# Altium project mcs4.PrjPcb
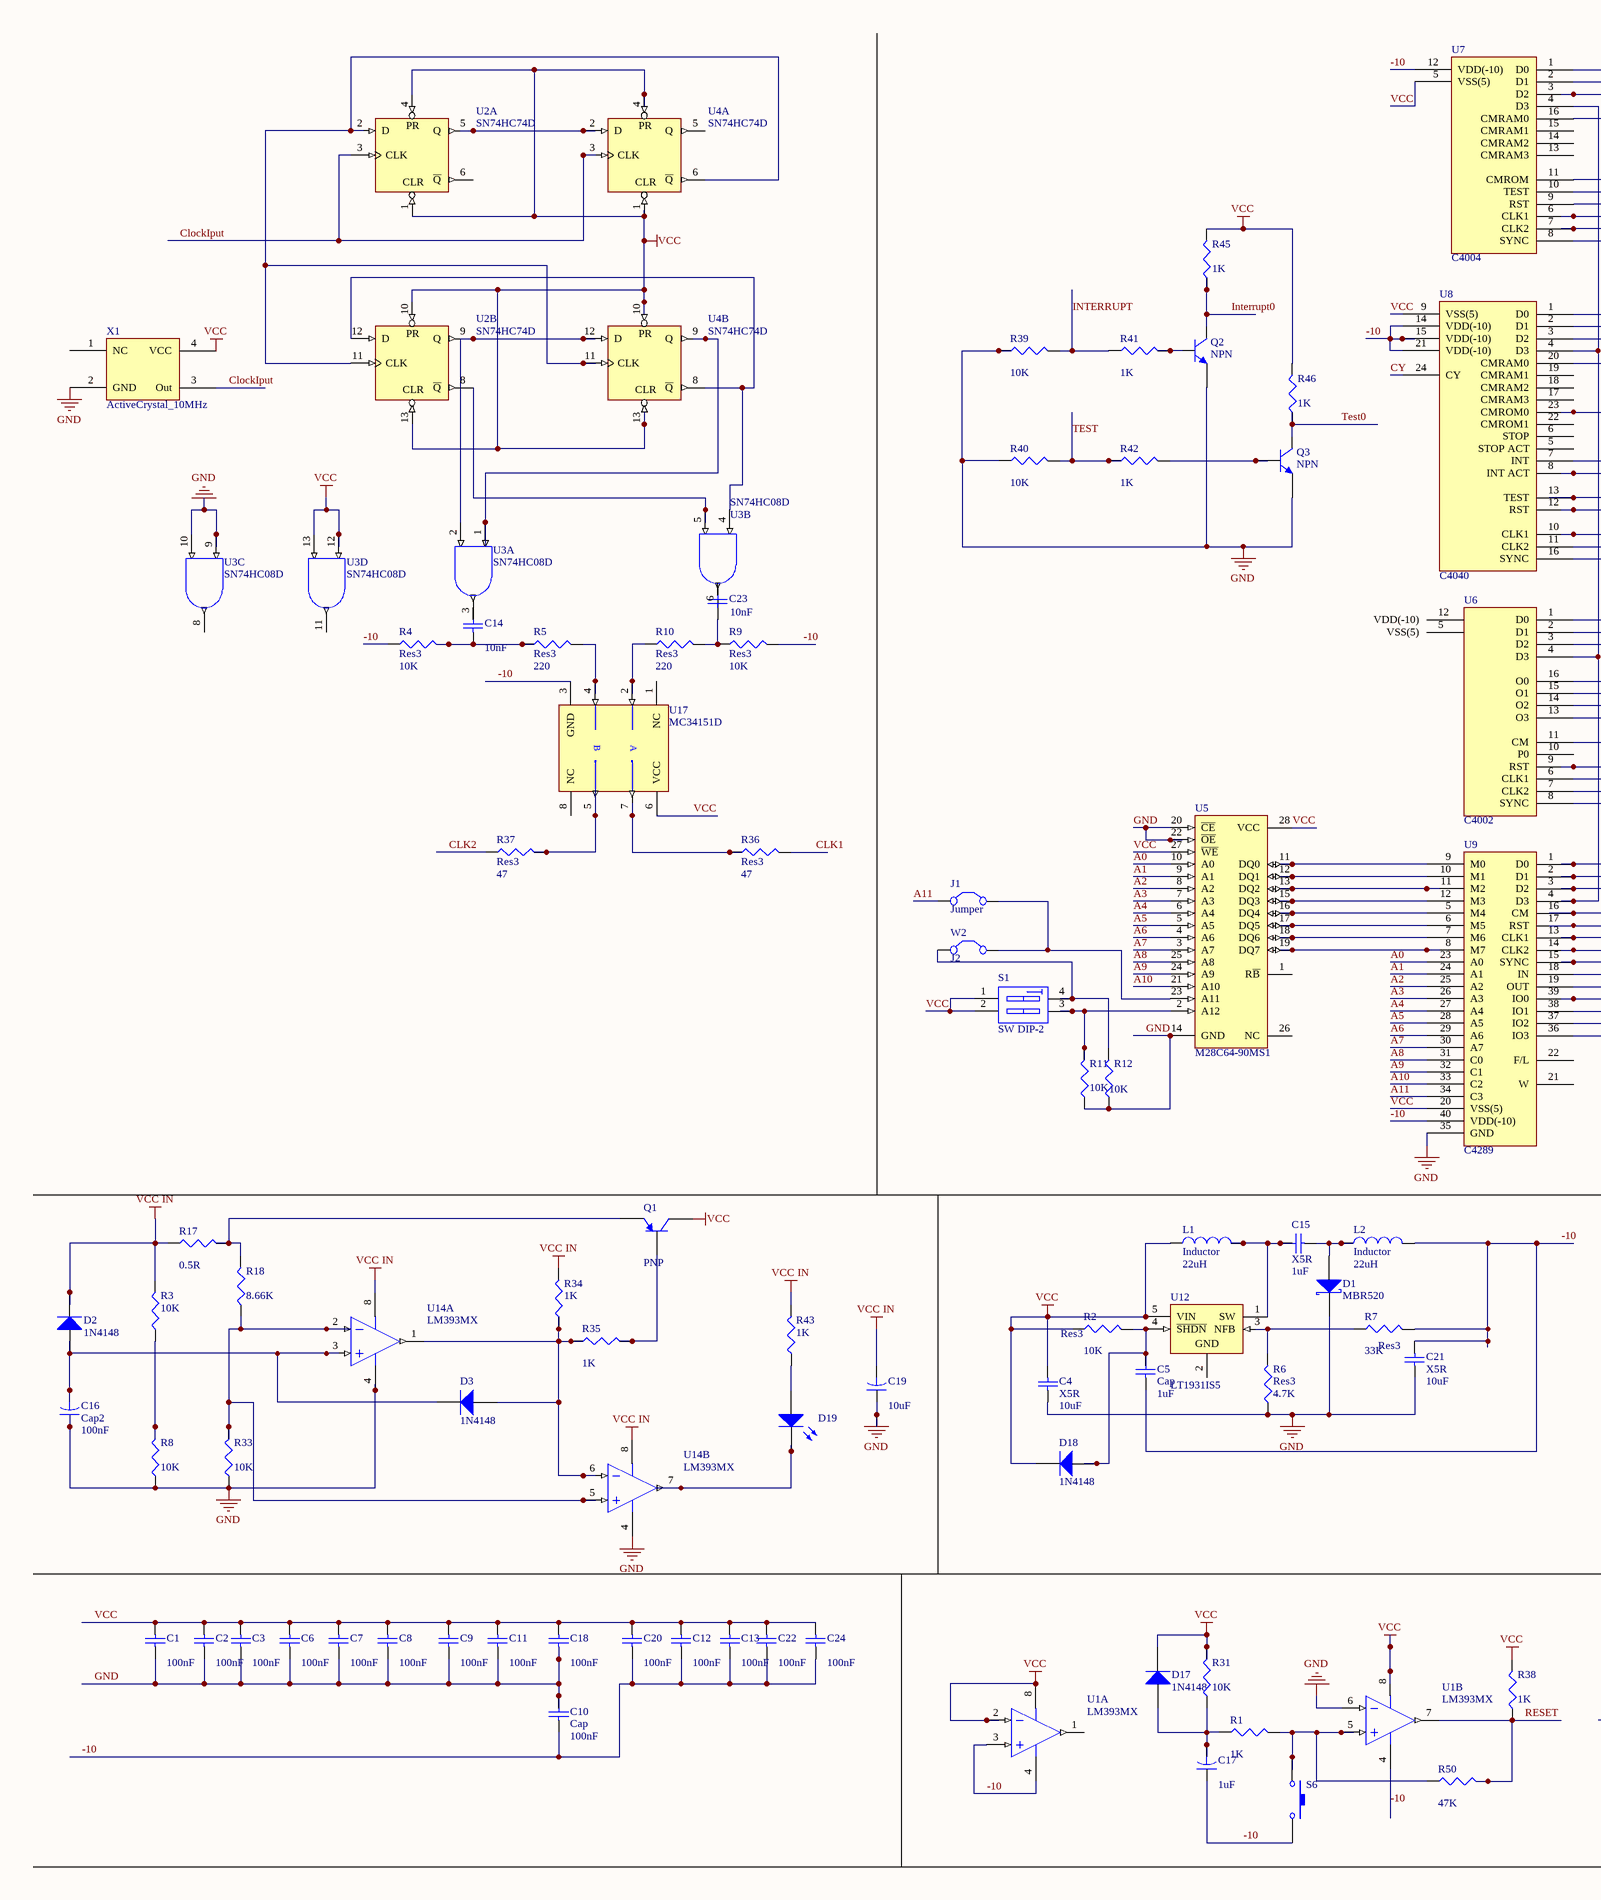
[diagram p0: MCS4-2.SchDoc, left]
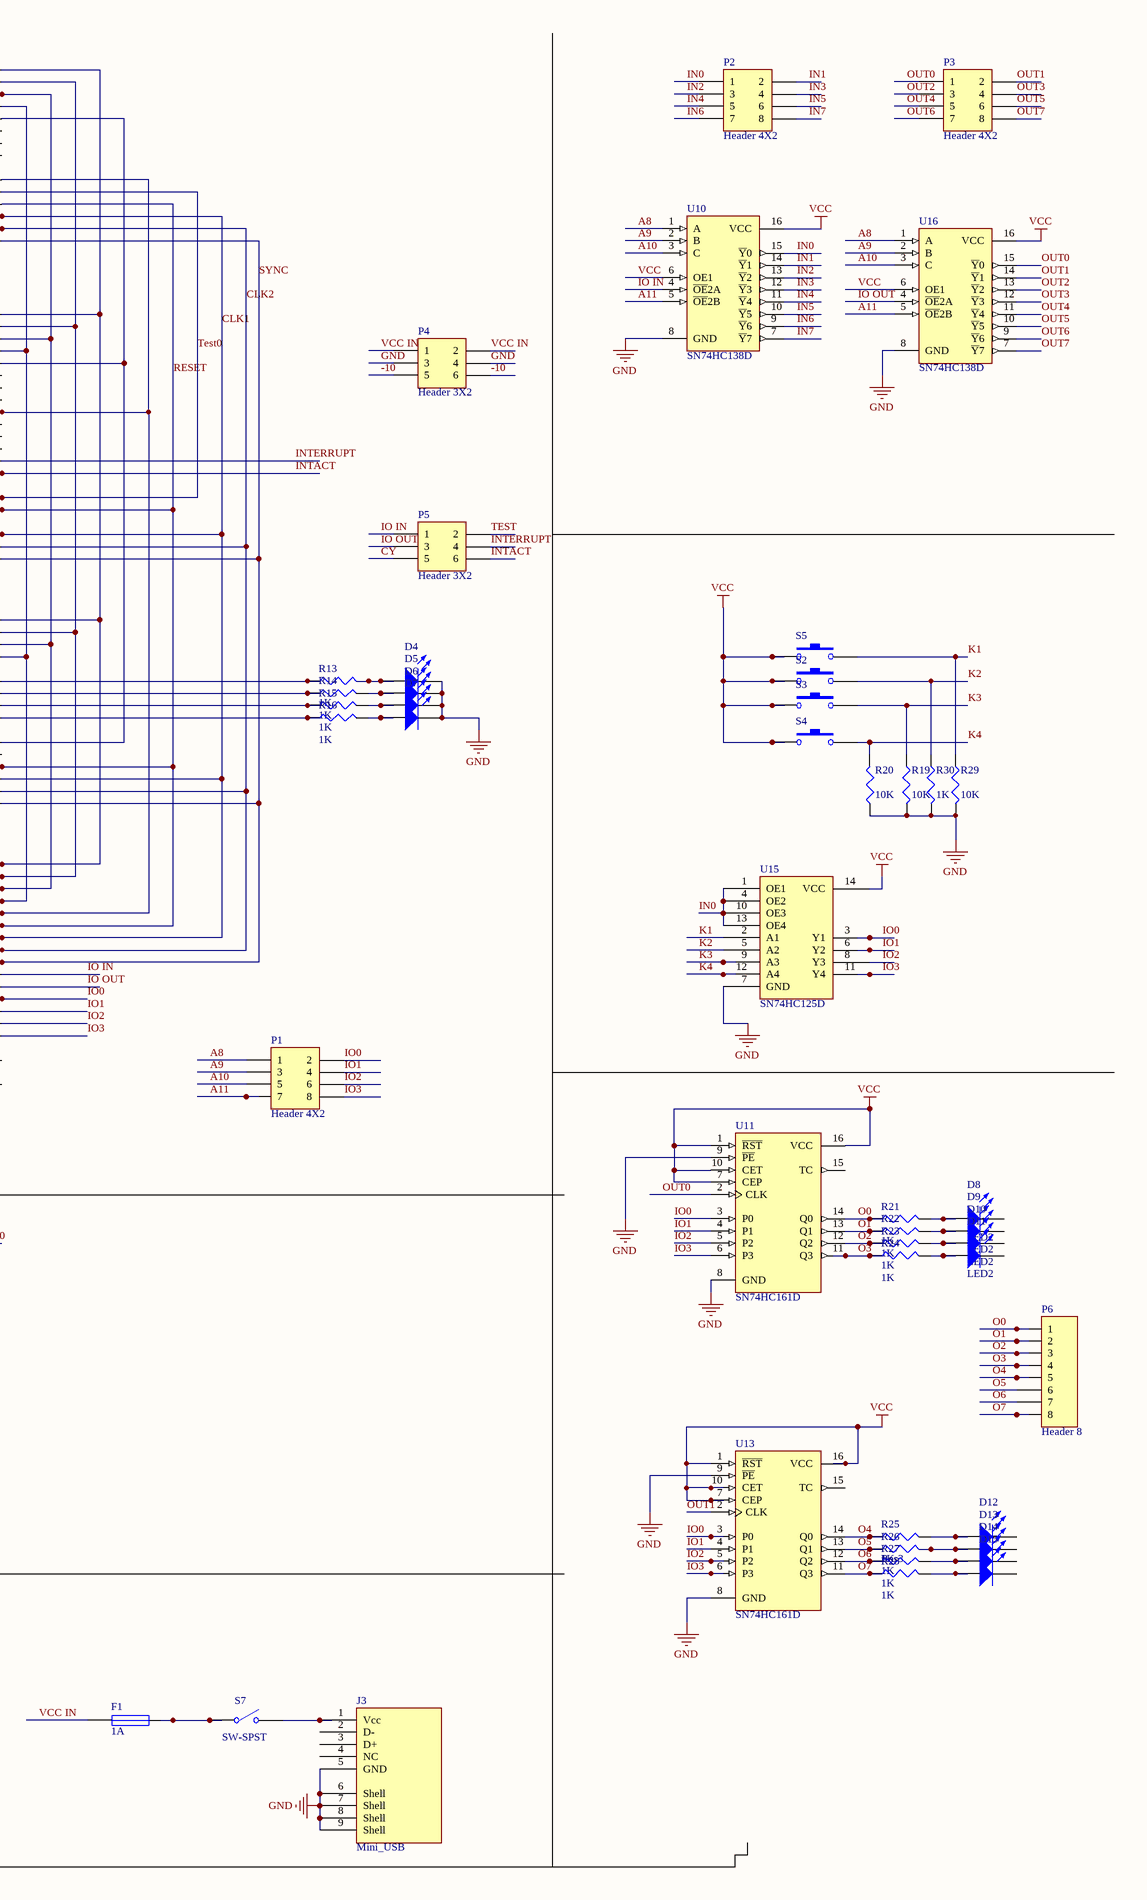
[diagram p1: MCS4-2.SchDoc, right]
1 sheet, 127 parts. Net scope: global (net labels, ports and power ports of the same name join across sheets).
Board file: MCS4.PcbDoc

## Sheet MCS4-2.SchDoc
size A2

### Parts
C1  value 100nF  [RAD-0.3]  (hidden comment: Cap)
C2  value 100nF  [RAD-0.3]  (hidden comment: Cap)
C3  value 100nF  [RAD-0.3]  (hidden comment: Cap)
C4  X5R  value 10uF  [RAD-0.3]
C5  Cap  value 1uF  [RAD-0.3]
C6  value 100nF  [RAD-0.3]  (hidden comment: Cap)
C7  value 100nF  [RAD-0.3]  (hidden comment: Cap)
C8  value 100nF  [RAD-0.3]  (hidden comment: Cap)
C9  value 100nF  [RAD-0.3]  (hidden comment: Cap)
C10  Cap  value 100nF  [RAD-0.3]
C11  value 100nF  [RAD-0.3]  (hidden comment: Cap)
C12  value 100nF  [RAD-0.3]  (hidden comment: Cap)
C13  value 100nF  [RAD-0.3]  (hidden comment: Cap)
C14  value 10nF  [RAD-0.3]
C15  X5R  value 1uF  [RAD-0.3]
C16  Cap2  value 100nF  [CAPR5-4X5]
C17  value 1uF  [CAPR5-4X5]  (hidden comment: Cap2)
C18  value 100nF  [RAD-0.3]  (hidden comment: Cap)
C19  value 10uF  [CAPR5-4X5]  (hidden comment: Cap2)
C20  value 100nF  [RAD-0.3]  (hidden comment: Cap)
C21  X5R  value 10uF  [RAD-0.3]
C22  value 100nF  [RAD-0.3]  (hidden comment: Cap)
C23  value 10nF  [RAD-0.3]  (hidden comment: Cap)
C24  value 100nF  [RAD-0.3]  (hidden comment: Cap)
D1  MBR520  [SMB]
D2  1N4148  [DO-35]
D3  1N4148  [DO-35]
D4  LED2  [3.2X1.6X1.1]  (value not drawn)
D5  LED2  [3.2X1.6X1.1]  (value not drawn)
D6  LED2  [3.2X1.6X1.1]  (value not drawn)
D7  LED2  [3.2X1.6X1.1]  (value not drawn)
D8  LED2  [3.2X1.6X1.1]
D9  LED2  [3.2X1.6X1.1]
D10  LED2  [3.2X1.6X1.1]
D11  LED2  [3.2X1.6X1.1]
D12  LED2  [3.2X1.6X1.1]  (value not drawn)
D13  LED2  [3.2X1.6X1.1]  (value not drawn)
D14  LED2  [3.2X1.6X1.1]  (value not drawn)
D15  LED2  [3.2X1.6X1.1]  (value not drawn)
D17  1N4148  [DO-35]
D18  1N4148  [DO-35]
D19  LED2  [3.2X1.6X1.1]  (value not drawn)
F1  1A  [PIN-W2/E2.8]
J1  Jumper  [RAD-0.2]
J3  Mini_USB  [Mini_USB]
L1  Inductor  value 22uH  [INDP110102X50N]
L2  Inductor  value 22uH  [INDP110102X50N]
P1  Header 4X2  [HDR2X4]
P2  Header 4X2  [HDR2X4]
P3  Header 4X2  [HDR2X4]
P4  Header 3X2  [HDR2X3]
P5  Header 3X2  [HDR2X3]
P6  Header 8  [HDR1X8]
Q1  PNP  [SOT-23B_N]
Q2  NPN  [TO-226-AA]
Q3  NPN  [TO-226-AA]
R1  value 1K  [J1-0603]  (hidden comment: Res3)
R2  Res3  value 10K  [J1-0603]
R3  value 10K  [J1-0603]  (hidden comment: Res3)
R4  Res3  value 10K  [J1-0603]
R5  Res3  value 220  [J1-0603]
R6  Res3  value 4.7K  [J1-0603]
R7  Res3  value 33K  [J1-0603]
R8  value 10K  [J1-0603]  (hidden comment: Res3)
R9  Res3  value 10K  [J1-0603]
R10  Res3  value 220  [J1-0603]
R11  value 10K  [J1-0603]  (hidden comment: Res3)
R12  value 10K  [J1-0603]  (hidden comment: Res3)
R13  value 1K  [J1-0603]  (hidden comment: Res3)
R14  value 1K  [J1-0603]  (hidden comment: Res3)
R15  value 1K  [J1-0603]  (hidden comment: Res3)
R16  value 1K  [J1-0603]  (hidden comment: Res3)
R17  value 0.5R  [J1-0603]  (hidden comment: Res3)
R18  value 8.66K  [J1-0603]  (hidden comment: Res3)
R19  value 10K  [J1-0603]  (hidden comment: Res3)
R20  value 10K  [J1-0603]  (hidden comment: Res3)
R21  value 1K  [J1-0603]  (hidden comment: Res3)
R22  value 1K  [J1-0603]  (hidden comment: Res3)
R23  value 1K  [J1-0603]  (hidden comment: Res3)
R24  value 1K  [J1-0603]  (hidden comment: Res3)
R25  value 1K  [J1-0603]  (hidden comment: Res3)
R26  Res3  value 1K  [J1-0603]
R27  value 1K  [J1-0603]  (hidden comment: Res3)
R28  value 1K  [J1-0603]  (hidden comment: Res3)
R29  value 10K  [J1-0603]  (hidden comment: Res3)
R30  value 1K  [J1-0603]  (hidden comment: Res3)
R31  value 10K  [J1-0603]  (hidden comment: Res3)
R33  value 10K  [J1-0603]  (hidden comment: Res3)
R34  value 1K  [J1-0603]  (hidden comment: Res3)
R35  value 1K  [J1-0603]  (hidden comment: Res3)
R36  Res3  value 47  [J1-0603]
R37  Res3  value 47  [J1-0603]
R38  value 1K  [J1-0603]  (hidden comment: Res3)
R39  value 10K  [J1-0603]  (hidden comment: Res3)
R40  value 10K  [J1-0603]  (hidden comment: Res3)
R41  value 1K  [J1-0603]  (hidden comment: Res3)
R42  value 1K  [J1-0603]  (hidden comment: Res3)
R43  value 1K  [J1-0603]  (hidden comment: Res3)
R45  value 1K  [J1-0603]  (hidden comment: Res3)
R46  value 1K  [J1-0603]  (hidden comment: Res3)
R50  value 47K  [J1-0603]  (hidden comment: Res3)
S1  SW DIP-2  [DIP-4]
S2  SW-PB  [SPST-2]  (value not drawn)
S3  SW-PB  [SPST-2]  (value not drawn)
S4  SW-PB  [SPST-2]  (value not drawn)
S5  SW-PB  [SPST-2]  (value not drawn)
S6  SW-PB  [SPST-2]  (value not drawn)
S7  SW-SPST  [SPST-2]
U1  LM393MX  [M08A_N]  (parts A,B of 2)
U2  SN74HC74D  [D014_N]  (parts A,B of 2)
U3  SN74HC08D  [D014_N]  (parts A,B,C,D of 4)
U4  SN74HC74D  [D014_N]  (parts A,B of 2)
U5  M28C64-90MS1  [SO28_N]
U6  C4002  [P4002]
U7  C4004  [P4004]
U8  C4040  [P4040]
U9  C4289  [C4289]
U10  SN74HC138D  [D016_N]
U11  SN74HC161D  [D016_N]
U12  LT1931IS5  [S5-T_N]
U13  SN74HC161D  [D016_N]
U14  LM393MX  [M08A_N]  (parts A,B of 2)
U15  SN74HC125D  [SN74HC125D]
U16  SN74HC138D  [D016_N]
U17  MC34151D  [751-06_N]
W2  J2  [RAD-0.2]
X1  ActiveCrystal_10MHz  [ActiveCrystal_10MHz_7050]

### Nets
GND: C1.1 C2.1 C3.1 C4.1 C6.1 C7.1 C8.1 C9.1 C10.2 C11.1 C16.1 C18.1 C19.1 C21.1 D1.2(K) D4.2(K) D5.2(K) D6.2(K) D7.2(K) J3.5(GND) J3.6(Shell) J3.7(Shell) J3.8(Shell) J3.9(Shell) P4.3 P4.4 Q2.3(E) Q3.3(E) R6.1 R8.1 R11.1 R12.1 R19.2 R20.1 R29.2 R30.2 R33.1 R39.1 R40.1 U1.6(INB-) U2.7(GND) U3.7(GND) U3.9(A) U3.10(B) U4.7(GND) U5.14(GND) U5.20(~{CE}) U5.22(~{OE}) U9.35(GND) U10.8(GND) U11.8(GND) U11.9(~{PE}) U13.8(GND) U13.9(~{PE}) U14.4(GND) U15.7(GND) U16.8(GND) X1.2(GND)
VCC: C1.2 C2.2 C3.2 C4.2 C6.2 C7.2 C8.2 C9.2 C11.2 C12.2 C13.2 C18.2 C20.2 C22.2 C24.2 D17.2(K) D18.2(K) L1.1 Q1.1(C) R2.1 R31.2 R38.2 R45.2 R46.2 S1.1(A1) S1.2(A2) S2.1 S3.1 S4.1 S5.1 U1.2(INA-) U1.8(V+) U2.1(CLR) U2.4(PR) U2.10(PR) U2.13(CLR) U2.14(VCC) U3.12(A) U3.13(B) U3.14(VCC) U4.1(CLR) U4.4(PR) U4.10(PR) U4.13(CLR) U4.14(VCC) U5.27(~{WE}) U5.28(VCC) U7.5(VSS(5)) U8.9(VSS(5)) U9.20(VSS(5)) U10.6(OE1) U10.16(VCC) U11.1(~{RST}) U11.7(CEP) U11.10(CET) U11.16(VCC) U12.5(VIN) U13.1(~{RST}) U13.7(CEP) U13.10(CET) U13.16(VCC) U15.14(VCC) U16.6(OE1) U16.16(VCC) U17.6(VCC) X1.4(VCC)
VCC IN: C19.2 D2.2(K) F1.1 P4.1 P4.2 R3.2 R17.1 R34.2 R43.2 U14.8(V+)
-10: C5.1 C10.1 C12.1 C13.1 C17.1 C20.1 C21.2 C22.1 C24.1 L2.2 P4.5 P4.6 R4.1 R7.2 R9.2 S6.2 U1.3(INA+) U1.4(GND) U7.12(VDD(-10)) U8.14(VDD(-10)) U8.15(VDD(-10)) U8.21(VDD(-10)) U9.40(VDD(-10)) U17.3(GND)
A0: U5.10(A0) U9.23(A0)
A1: U5.9(A1) U9.24(A1)
A2: U5.8(A2) U9.25(A2)
A3: U5.7(A3) U9.26(A3)
A4: U5.6(A4) U9.27(A4)
A5: U5.5(A5) U9.28(A5)
A6: U5.4(A6) U9.29(A6)
A7: U5.3(A7) U9.30(A7)
A8: P1.1 U5.25(A8) U9.31(C0) U10.1(A) U16.1(A)
A9: P1.3 U5.24(A9) U9.32(C1) U10.2(B) U16.2(B)
A10: P1.5 U5.21(A10) U9.33(C2) U10.3(C) U16.3(C)
A11: J1.1(C1) P1.7 U9.34(C3) U10.5(~{OE}2B) U16.5(~{OE}2B)
CLK1: R36.2 U6.6(CLK1) U7.6(CLK1) U8.10(CLK1) U9.13(CLK1)
CLK2: R37.1 U6.7(CLK2) U7.7(CLK2) U8.11(CLK2) U9.14(CLK2)
ClockIput: U2.3(CLK) U4.3(CLK) X1.3(Out)
CY: P5.5 U8.24(CY)
IN0: P2.1 U10.15(~{Y}0) U15.1(OE1) U15.4(OE2) U15.10(OE3) U15.13(OE4)
IN1: P2.2 U10.14(~{Y}1)
IN2: P2.3 U10.13(~{Y}2)
IN3: P2.4 U10.12(~{Y}3)
IN4: P2.5 U10.11(~{Y}4)
IN5: P2.6 U10.10(~{Y}5)
IN6: P2.7 U10.9(~{Y}6)
IN7: P2.8 U10.7(~{Y}7)
INTACT: P5.6 U8.8(INT_ACT)
INTERRUPT: P5.4 R39.2 R41.1 U8.7(INT)
Interrupt0: Q2.1(C) R45.1
IO0: P1.2 U9.39(IO0) U11.3(P0) U13.3(P0) U15.3(Y1)
IO1: P1.4 U9.38(IO1) U11.4(P1) U13.4(P1) U15.6(Y2)
IO2: P1.6 U9.37(IO2) U11.5(P2) U13.5(P2) U15.8(Y3)
IO3: P1.8 U9.36(IO3) U11.6(P3) U13.6(P3) U15.11(Y4)
IO IN: P5.1 U9.18(IN) U10.4(~{OE}2A)
IO OUT: P5.3 U9.19(OUT) U16.4(~{OE}2A)
K1: R29.1 S5.2 U15.2(A1)
K2: R30.1 S2.2 U15.5(A2)
K3: R19.1 S3.2 U15.9(A3)
K4: R20.2 S4.2 U15.12(A4)
O0: P6.1 R21.1 U11.14(Q0)
O1: P6.2 R22.1 U11.13(Q1)
O2: P6.3 R23.1 U11.12(Q2)
O3: P6.4 R24.1 U11.11(Q3)
O4: P6.5 R25.1 U13.14(Q0)
O5: P6.6 R26.1 U13.13(Q1)
O6: P6.7 R27.1 U13.12(Q2)
O7: P6.8 R28.1 U13.11(Q3)
OUT0: P3.1 U11.2(CLK) U16.15(~{Y}0)
OUT1: P3.2 U13.2(CLK) U16.14(~{Y}1)
OUT2: P3.3 U16.13(~{Y}2)
OUT3: P3.4 U16.12(~{Y}3)
OUT4: P3.5 U16.11(~{Y}4)
OUT5: P3.6 U16.10(~{Y}5)
OUT6: P3.7 U16.9(~{Y}6)
OUT7: P3.8 U16.7(~{Y}7)
RESET: R38.1 R50.2 U1.7(OUTB) U6.9(RST) U7.9(RST) U8.12(RST) U9.17(RST)
SYNC: U6.8(SYNC) U7.8(SYNC) U8.16(SYNC) U9.15(SYNC)
TEST: P5.2 R40.2 R42.1
Test0: Q3.1(C) R46.1 U7.10(TEST) U8.13(TEST)
NetC5_2: C5.2 D18.1(A) R2.2 U12.4(~{SHDN})
NetC14_1: C14.1 R4.2 R5.1
NetC15_1: C15.1 L1.2 U12.1(SW)
NetC15_2: C15.2 D1.1(A) L2.1
NetC16_2: C16.2 D2.1(A) D3.2(K) U14.3(INA+)
NetC17_2: C17.2 D17.1(A) R1.1 R31.1
NetC23_1: C23.1 R9.1 R10.2
NetD3_1: D3.1(A) R34.1 R35.1 U14.1(OUTA) U14.6(INB-)
NetD4_1: D4.1(A) R13.2
NetD5_1: D5.1(A) R14.2
NetD6_1: D6.1(A) R15.2
NetD7_1: D7.1(A) R16.2
NetD8_1: D8.1(A) R21.2
NetD9_1: D9.1(A) R22.2
NetD10_1: D10.1(A) R23.2
NetD11_1: D11.1(A) R24.2
NetD12_1: D12.1(A) R25.2
NetD13_1: D13.1(A) R26.2
NetD14_1: D14.1(A) R27.2
NetD15_1: D15.1(A) R28.2
NetD19_1: D19.1(A) R43.1
NetD19_2: D19.2(K) U14.7(OUTB)
NetF1_2: F1.2 S7.1(COMMON)
NetJ1_2: J1.2(C2) U5.23(A11) W2.2(C2)
NetJ3_1: J3.1(Vcc) S7.2(NO)
NetQ1_2: Q1.2(B) R35.2
NetQ1_3: Q1.3(E) R17.2 R18.2
NetQ2_2: Q2.2(B) R41.2
NetQ3_2: Q3.2(B) R42.2
NetR1_2: R1.2 R50.1 S6.1 U1.5(INB+)
NetR3_1: R3.1 R8.2
NetR5_2: R5.2 U17.4(INB)
NetR6_2: R6.2 R7.1 U12.3(NFB)
NetR10_1: R10.1 U17.2(INA)
NetR11_2: R11.2 S1.3(B2) U5.2(A12)
NetR12_2: R12.2 S1.4(B1) W2.1(C1)
NetR13_1: R13.1 U6.16(O0)
NetR14_1: R14.1 U6.15(O1)
NetR15_1: R15.1 U6.14(O2)
NetR16_1: R16.1 U6.13(O3)
NetR18_1: R18.1 R33.2 U14.2(INA-) U14.5(INB+)
NetR36_1: R36.1 U17.7(~{OUTA})
NetR37_2: R37.2 U17.5(~{OUTB})
NetU2_2: U2.2(D) U2.11(CLK) U4.6(~{Q}) U4.11(CLK)
NetU2_5: U2.5(Q) U4.2(D)
NetU2_8: U2.8(~{Q}) U3.5(B)
NetU2_9: U2.9(Q) U3.2(B) U4.12(D)
NetU2_12: U2.12(D) U3.4(A) U4.8(~{Q})
NetU3_1: U3.1(A) U4.9(Q)
NetU5_11: U5.11(DQ0) U9.9(M0)
NetU5_12: U5.12(DQ1) U9.10(M1)
NetU5_13: U5.13(DQ2) U9.11(M2)
NetU5_15: U5.15(DQ3) U9.12(M3)
NetU5_16: U5.16(DQ4) U9.5(M4)
NetU5_17: U5.17(DQ5) U9.6(M5)
NetU5_18: U5.18(DQ6) U9.7(M6)
NetU5_19: U5.19(DQ7) U9.8(M7)
NetU6_1: U6.1(D0) U7.1(D0) U8.1(D0) U9.1(D0)
NetU6_2: U6.2(D1) U7.2(D1) U8.2(D1) U9.2(D1)
NetU6_3: U6.3(D2) U7.3(D2) U8.3(D2) U9.3(D2)
NetU6_4: U6.4(D3) U7.4(D3) U8.4(D3) U9.4(D3)
NetU6_11: U6.11(CM) U7.16(CMRAM0) U8.20(CMRAM0)
NetU7_11: U7.11(CMROM) U8.23(CMROM0) U9.16(CM)

Not connected (* = marked no-connect by the designer): C14 2; C23 2; D8 2(K); D9 2(K); D10 2(K); D11 2(K); D12 2(K); D13 2(K); D14 2(K); D15 2(K); J3 2(D-) 3(D+) 4(NC); U1 1(OUTA); U2 6(~{Q}); U3 3(Y) 6(Y) 8(Y) 11(Y); U4 5(Q); U5 1(R~{B}) 26(NC); U6 5(VSS(5)) 10(P0) 12(VDD(-10)); U7 13(CMRAM3) 14(CMRAM2) 15(CMRAM1); U8 5(STOP_ACT) 6(STOP) 17(CMRAM3) 18(CMRAM2) 19(CMRAM1) 22(CMROM1); U9 21(W) 22(F/L); U11 15(TC); U12 2(GND); U13 15(TC); U17 1(NC) 8(NC); X1 1(NC)

### Notes on the sheet
- (in symbol MC34151D) B; A

### Library data of the parts
C1-C14 C18 C20-C24 = Cap: Capacitor; Published: 8-Jun-2000; LatestRevisionDate: 17-Jul-2002; LatestRevisionNote: Re-released for DXP Platform.; PackageReference: RAD-0.3; Publisher: Altium Limited; PackageDescription: Radial Cap, Thru-Hole; 2 Leads; 0.3 in Pin Spacing
C15 = Cap: Published: 8-Jun-2000; LatestRevisionDate: 17-Jul-2002; LatestRevisionNote: Re-released for DXP Platform.; PackageReference: RAD-0.3; Publisher: Altium Limited; PackageDescription: Radial Cap, Thru-Hole; 2 Leads; 0.3 in Pin Spacing
C16 C17 C19 = Cap2: Capacitor; Published: 23-Sep-2002; PackageReference: CAPR5-4X5; Publisher: Altium Limited; PackageDescription: Capacitor; 2 Leads
D1 = D Schottky: Published: 8-Jun-2000; LatestRevisionDate: 17-Jul-2002; LatestRevisionNote: Re-released for DXP Platform.; PackageReference: SMB; Publisher: Altium Limited; PackageDescription: DO-214-AA/SMB; 2 C-Bend Leads; Body 5.3 x 3.6 mm, inc. leads (LxW); Code_JEDEC: DO-214-AA
D2 D3 D17 D18 = 1N4148: High Conductance Fast Diode; Published: 8-Jun-2000; LatestRevisionDate: 17-Jul-2002; LatestRevisionNote: Re-released for DXP Platform.; DatasheetDocument: 1997; PackageReference: DO-35; Publisher: Altium Limited; Code_JEDEC: DO-204-AH; ComponentLink1Description: Manufacturer Link; ComponentLink1URL: http://www.fairchildsemi.com/; ComponentLink2Description: Datasheet; ComponentLink2URL: http://www.fairchildsemi.com/ds/1N%2F1N4148.pdf
D4-D15 D19 = LED2: Typical RED, GREEN, YELLOW, AMBER GaAs LED; Published: 8-Jun-2000; LatestRevisionDate: 17-Jul-2002; LatestRevisionNote: Re-released for DXP Platform.; PackageVersion: Feb-2002; PackageReference: 3.2X1.6X1.1; Publisher: Altium Limited; PackageDescription: SM LED; 2 Flat Leads
F1 = Fuse 1: Published: 8-Jun-2000; LatestRevisionDate: 17-Jul-2002; LatestRevisionNote: Re-released for DXP Platform.; PackageReference: PIN-W2/E2.8; Publisher: Altium Limited; PackageDescription: Thru-Hole; 2 Leads
J1 W2 = Jumper: Jumper Wire; Published: 24-Mar-1999; LatestRevisionDate: 17-Jul-2002; LatestRevisionNote: Re-released for DXP Platform.; PackageReference: RAD-0.2; Publisher: Altium Limited; PackageDescription: Radial Cap, Thru-Hole; 2 Leads; 0.2 in Pin Spacing
J3 = usbmin2
L1 L2 = Inductor: Code_IEC: 1005; Published: 8-Jun-2000; LatestRevisionDate: 29-May-2009; LatestRevisionNote: IPC-7351 Footprint Added.; PackageReference: 0402-A; Publisher: Altium Limited; PackageDescription: Chip Inductor; Code_JEITA: 0402
P1-P3 = Header 4X2: Header, 4-Pin, Dual row; LatestRevisionDate: 17-Jul-2002; LatestRevisionNote: Re-released for DXP Platform.; Publisher: Altium Limited
P4 P5 = Header 3X2: Header, 3-Pin, Dual row; LatestRevisionDate: 17-Jul-2002; LatestRevisionNote: Re-released for DXP Platform.; Publisher: Altium Limited
P6 = Header 8: Header, 8-Pin; LatestRevisionDate: 17-Jul-2002; LatestRevisionNote: Re-released for DXP Platform.; Publisher: Altium Limited
Q1 = PNP: PNP Bipolar Transistor; Published: 8-Jun-2000; LatestRevisionDate: 29-May-2009; LatestRevisionNote: IPC-7351 Footprint Added.; PackageVersion: Aug-1999; PackageReference: SOT-23B; Publisher: Altium Limited; PackageDescription: 3-Pin SOT-23 Package 0.95 mm Pitch, 2.4 mm Lead Span
Q2 Q3 = NPN: NPN Bipolar Transistor; Published: 8-Jun-2000; LatestRevisionDate: 17-Jul-2002; LatestRevisionNote: Re-released for DXP Platform.; PackageReference: TO-226-AA; Publisher: Altium Limited; PackageDescription: TO, Flat Index; 3 In-Line, Axial Leads; Body Dia. 4.8mm; Leads 0.55 x 0.51 mm (max); Code_JEDEC: TO-226-AA
R1-R31 R33-R43 R45 R46 R50 = Res3: Resistor; Published: 8-Jun-2000; LatestRevisionDate: 29-May-2009; LatestRevisionNote: IPC-7351 Footprint Added.; PackageReference: J1-0603; Publisher: Altium Limited; PackageDescription: Chip Resistor
S1 = SW DIP-2: DIP Switch, 2 Position, SPST; Published: 24-Mar-1999; LatestRevisionDate: 17-Jul-2002; LatestRevisionNote: Re-released for DXP Platform.; PackageReference: DIP-4; Publisher: Altium Limited
S2-S6 = SW-PB: Switch; Published: 24-Mar-1999; LatestRevisionDate: 17-Jul-2002; LatestRevisionNote: Re-released for DXP Platform.; PackageReference: SPST-2; Publisher: Altium Limited; PackageDescription: Switch; 2 Leads
S7 = SW-SPST: Single-Pole, Single-Throw Switch; Published: 24-Mar-1999; LatestRevisionDate: 17-Jul-2002; LatestRevisionNote: Re-released for DXP Platform.; PackageReference: SPST-2; Publisher: Altium Limited; PackageDescription: Switch; 2 Leads
U1 U14 = LM393MX: Low Power Low Offset Voltage Dual Comparator; Manufacturer: National Semiconductor; PackageTopMarking: NSZXTT*LM*393M; Published: 4-Dec-2008; DatasheetVersion: Aug-2002; PackageVersion: revL, Sep-2006; PackageReference: M08A; Publisher: Altium Limited; PackageDescription: SOIC Narrow, 4.9 x 3.9 x 1.45mm, 8 Lead, 1.27mm Pitch; CompType: Comparator; PartNumber: LM393MX; RoHS: O; PinCount: 8; DigiKeyPartNumber: LM393MXCT-ND; Code_JEDEC: MS-012-AA; Code_IPC: SOIC127P600-8; ComponentLink1Description: LM393 Datasheet; ComponentLink1URL: http://www.national.com/ds/LM/LM393.pdf; ComponentLink2Description: LM393  Web Page; ComponentLink2URL: http://www.national.com/pf/LM/LM393.html; ComponentLink3Description: M08A Package Page; ComponentLink3URL: http://www.national.com/packaging/folders/m08a.html
U2 U4 = SN74HC74D: Dual D-Type Positive-Edge-Triggered Flip-Flop with Clear and Preset; Published: 8-Jun-2000; LatestRevisionDate: 13-Apr-2006; LatestRevisionNote: IPC-7351 Footprint Added.; DatasheetVersion: May-1997; PackageVersion: Jan-1998; PackageReference: D014; Publisher: Altium Limited; PackageDescription: 14-Pin Small Outline Integrated Circuit 1.27 mm Pitch; Code_IPC: SOIC127P600-14; ComponentLink1Description: Manufacturer Link; ComponentLink1URL: http://www.ti.com/; ComponentLink2Description: Datasheet; ComponentLink2URL: http://www-s.ti.com/sc/ds/sn74hc74.pdf
U3 = SN74HC08D: Quadruple 2-Input Positive-AND Gate; Published: 8-Jun-2000; LatestRevisionDate: 13-Apr-2006; LatestRevisionNote: IPC-7351 Footprint Added.; DatasheetVersion: May-1997; PackageVersion: Jan-1998; PackageReference: D014; Publisher: Altium Limited; PackageDescription: 14-Pin Small Outline Integrated Circuit 1.27 mm Pitch; Code_IPC: SOIC127P600-14; ComponentLink1Description: Manufacturer Link; ComponentLink1URL: http://www.ti.com/; ComponentLink2Description: Datasheet; ComponentLink2URL: http://www-s.ti.com/sc/ds/SN74HC08.pdf
U5 = M28C64-90MS1: 64 Kbit (8K x 8) Parallel EEPROM with Software Data Protection; Published: 24-Aug-2001; LatestRevisionDate: 13-Apr-2006; LatestRevisionNote: IPC-7351 Footprint Added.; DatasheetVersion: Mar-1999; PackageVersion: Jul-2001; PackageReference: SO28; Publisher: Altium Limited; PackageDescription: 28-Pin Plastic Small Outline Integrated Circuit 1.27 mm Pitch; ComponentLink1Description: Manufacturer Link; ComponentLink1URL: http://www.st.com/
U10 U16 = SN74HC138D: 3-Line to 8-Line Decoder / Demultiplexer; Published: 8-Jun-2000; LatestRevisionDate: 13-Apr-2006; LatestRevisionNote: IPC-7351 Footprint Added.; DatasheetVersion: May-1997; PackageVersion: Jan-1998; PackageReference: D016; Publisher: Altium Limited; PackageDescription: 16-Pin Small Outline Integrated Circuit 1.27 mm Pitch; Code_IPC: SOIC127P600-16; ComponentLink1Description: Manufacturer Link; ComponentLink1URL: http://www.ti.com/; ComponentLink2Description: Datasheet; ComponentLink2URL: http://www-s.ti.com/sc/ds/sn74hc138.pdf
U11 U13 = SN74HC161D: 4-Bit Synchronous Binary Counter; Published: 8-Jun-2000; LatestRevisionDate: 13-Apr-2006; LatestRevisionNote: IPC-7351 Footprint Added.; DatasheetVersion: May-1997; PackageVersion: Jan-1998; PackageReference: D016; Publisher: Altium Limited; PackageDescription: 16-Pin Small Outline Integrated Circuit 1.27 mm Pitch; Code_IPC: SOIC127P600-16; ComponentLink1Description: Manufacturer Link; ComponentLink1URL: http://www.ti.com/; ComponentLink2Description: Datasheet; ComponentLink2URL: http://www-s.ti.com/sc/ds/sn74hc161.pdf
U12 = LT1931IS5: 1.2MHz Inverting Current Mode DC/DC Converter; Note: 1635; Published: 6-Jun-2005; LatestRevisionDate: 29-May-2009; LatestRevisionNote: IPC-7351 Footprint Added.; DatasheetVersion: Jun-2001; PackageVersion: 2005; PackageReference: S5-T; Publisher: Altium Limited; PackageDescription: 5-Pin SOT-23 Package 0.95 mm Pitch, 2.8 mm Lead Span; Code_IPC: SOT23-5; ComponentLink1Description: Manufacturer Link; ComponentLink1URL: http://www.linear.com/; ComponentLink2Description: Datasheet; ComponentLink2URL: http://www.linear.com/pc/downloadDocument.do?navId=H0,C1,C1003,C1042,P1863,D3921
U15 = SN74HC125D: U15
U17 = MC34151D: High Speed Dual MOSFET Driver; Published: 17-Jul-2002; LatestRevisionDate: 13-Apr-2006; LatestRevisionNote: IPC-7351 Footprint Added.; DatasheetVersion: Apr-2000; PackageVersion: Sep-1999; PackageReference: 751-06; Publisher: Altium Limited; PackageDescription: 8-Pin Small Outline Integrated Circuit 1.27 mm Pitch; Code_JEDEC: MS-012-AA; Code_IPC: SOIC127P600-8; ComponentLink1Description: Manufacturer Link; ComponentLink1URL: http://www.onsemi.com/site/products/parametrics/0,4446,388,00.html; ComponentLink2Description: Datasheet; ComponentLink2URL: http://www.onsemi.com/pub/Collateral/MC34151-D.PDF